# EAGLE design akabeacon_square_type2 (EAGLE 7.2.0)
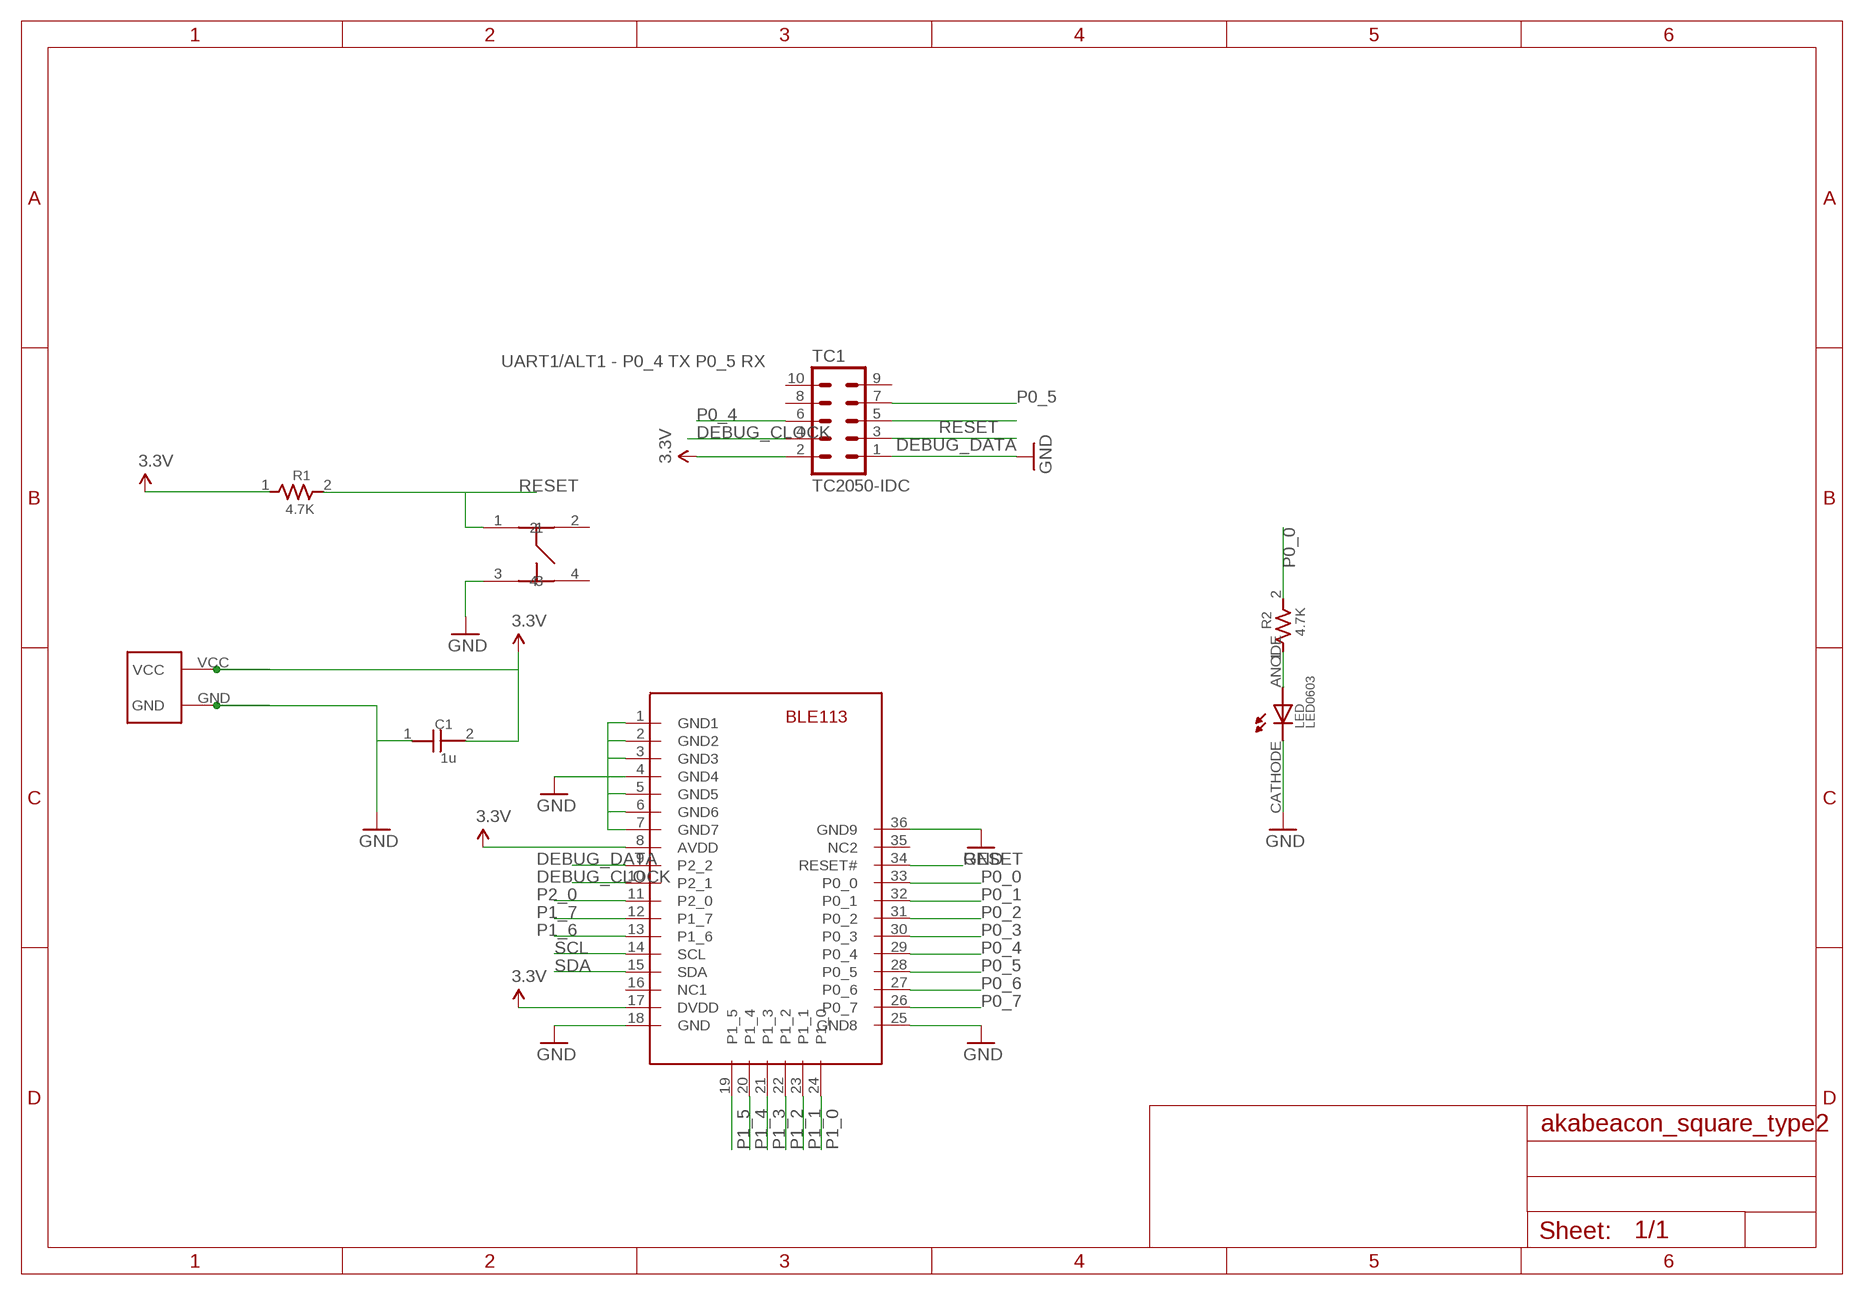
[diagram p0: schematic, sheet 1]

## Parts
C1  1u  CAPACITOR0603  [0603]
LED  LED0603  [0603]
R1  4.7K  RESISTOR0603  [0603]
R2  4.7K  RESISTOR0603  [0603]
TC1  TC2050-IDC  [TC2050-IDC-NL]
U$3  SQUARE-TYPE2-TC2050  [SQUARE-TYPE2-TC2050]
U$5  BLE113  [BLE113]
U$6  SWICTH-4P(KMR2)  [SWITCH-4P(KMR2)]

## Nets
3.3V: C1.2 R1.1 TC1.2 U$3.VCC U$5.8(AVDD) U$5.17(DVDD)
DEBUG_CLOCK: TC1.4 U$5.10(P2_1)
DEBUG_DATA: TC1.3 U$5.9(P2_2)
GND: C1.1 LED.CATHODE TC1.1 U$3.GND U$5.1(GND1) U$5.2(GND2) U$5.3(GND3) U$5.4(GND4) U$5.5(GND5) U$5.6(GND6) U$5.7(GND7) U$5.18(GND) U$5.25(GND8) U$5.36(GND9) U$6.3
N$2: LED.ANODE R2.1
P0_0: R2.2 U$5.33(P0_0)
P0_1: U$5.32(P0_1)
P0_2: U$5.31(P0_2)
P0_3: U$5.30(P0_3)
P0_4: TC1.6 U$5.29(P0_4)
P0_5: TC1.7 U$5.28(P0_5)
P0_6: U$5.27(P0_6)
P0_7: U$5.26(P0_7)
P1_0: U$5.24(P1_0)
P1_1: U$5.23(P1_1)
P1_2: U$5.22(P1_2)
P1_3: U$5.21(P1_3)
P1_4: U$5.20(P1_4)
P1_5: U$5.19(P1_5)
P1_6: U$5.13(P1_6)
P1_7: U$5.12(P1_7)
P2_0: U$5.11(P2_0)
RESET: R1.2 TC1.5 U$5.34(RESET#) U$6.1
SCL: U$5.14(SCL)
SDA: U$5.15(SDA)
Unconnected: TC1.8 TC1.9 TC1.10 U$5.16(NC1) U$5.35(NC2) U$6.2 U$6.4

## Notes on the sheet
- UART1/ALT1 - P0_4 TX P0_5 RX

## Library data of the parts
C1 = GClue-Capacitor:CAPACITOR
LED = GClue-LED:LED
R1 R2 = GClue-Resistors:RESISTOR
TC1 = TagConnect:TC2050-IDC: Tag-Connect In Circuit Programming & Debug Cable 10 Pin http://www.tag-connect.com
U$3 = GClue-Beacon:SQUARE-TYPE2-TC2050
U$5 = gclue:BLE113
U$6 = gclue:SWICTH-4P(KMR2)

## Board
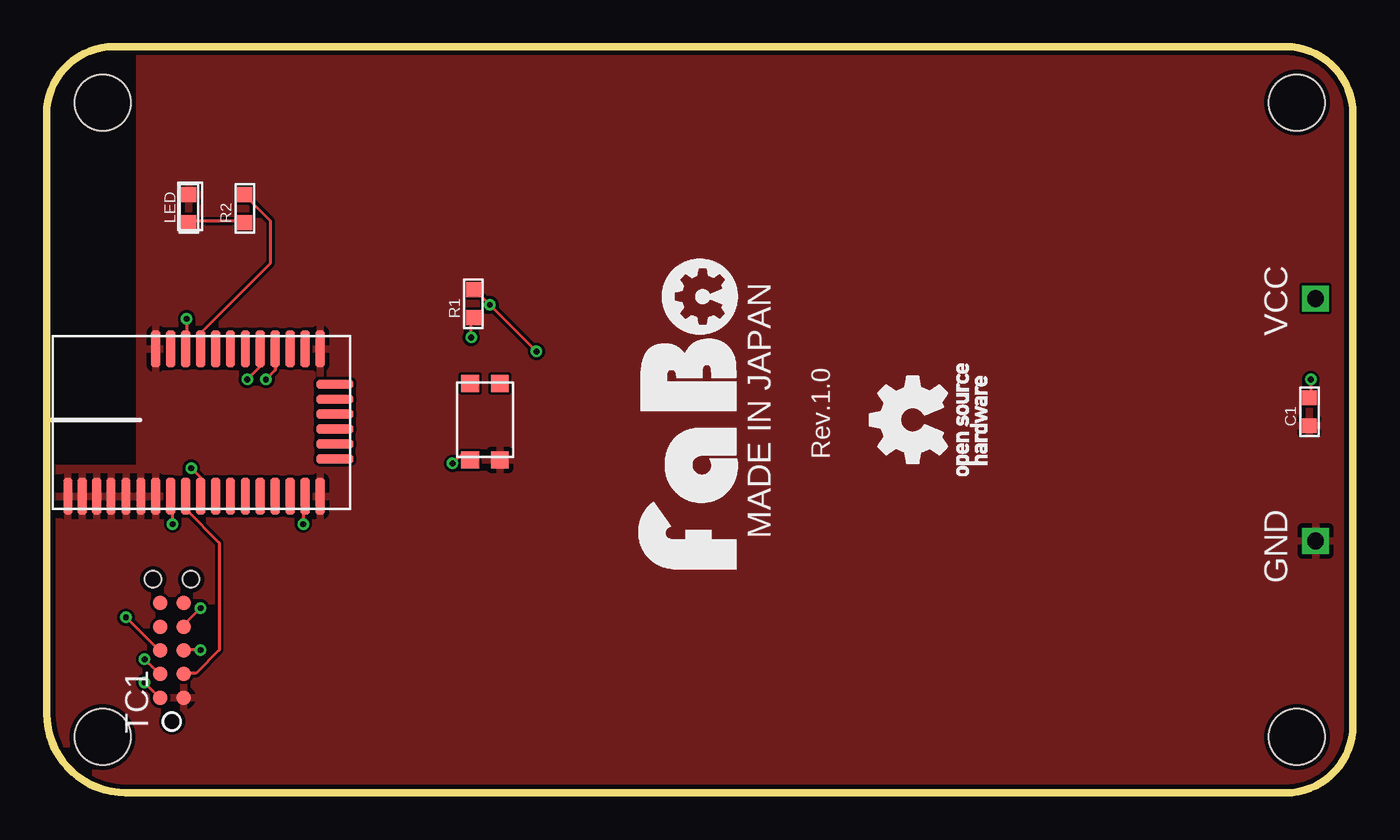
[diagram p1: board, top side]
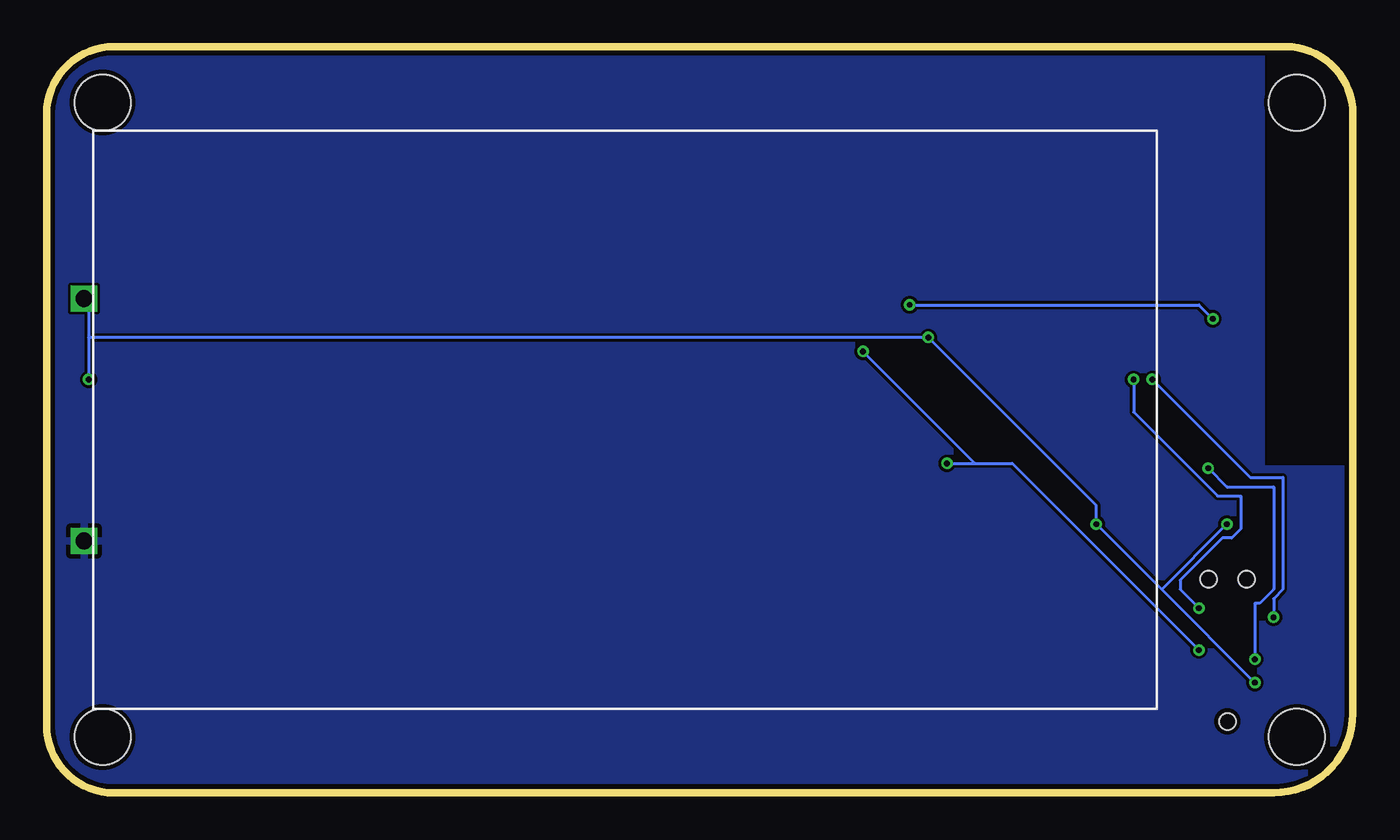
[diagram p2: board, bottom side, seen from below]

Size 70 x 40 mm. Coordinates in mm from the lower left corner, seen from the top.
Copper layers (1*16): Top 0.035mm / dielectric 1.5mm / Bottom 0.035mm
Design rules "SeeedStudio_2layer_DRU_no_angle_20140221": minimum track width 6mil, minimum drill 12mil, track to track 6mil, track to pad 6mil, pad to pad 6mil, via to via 6mil, smd to smd 0mil, copper to edge 10mil, drill to drill 10mil, minimum pad ring 10mil, minimum via ring 6mil, stop-mask expansion 2mil, vias tented up to drill 100mil, thermal gap 10mil
tRestrict: area -2.1,17.6 to 4.8,41
bRestrict: area -2.2,17.6 to 4.7,41

### Footprints (pad centres in the part's own frame; a part is rotated, then mirrored left to right if it is on the bottom)
0603 = smd 0.8 x 0.8: 1 -0.75,0; 2 0.75,0
0603' = smd 0.8 x 0.8: ANODE -0.75,0; CATHODE 0.75,0
TC2050-IDC-NL = smd 0.787 x 0.787: 1 -2.54,-0.635; 2 -2.54,0.635; 3 -1.27,-0.635; 4 -1.27,0.635; 5 0,-0.635; 6 0,0.635; 7 1.27,-0.635; 8 1.27,0.635; 9 2.54,-0.635; 10 2.54,0.635 | hole 0.889: -3.81,0; 3.81,-1.016; 3.81,1.016
SQUARE-TYPE2-TC2050 = drill 0.9 square: GND 33,-6.5; VCC 33,6.5 | hole 3: -32,17; -32,-17; 32,-17; 32,17
BLE113 = smd 2 x 0.5: 1 -5.08,5.08; 2 -5.08,4.31; 3 -5.08,3.54; 4 -5.08,2.77; 5 -5.08,1.97; 6 -5.08,1.17; 7 -5.08,0.37; 8 -5.08,-0.43; 9 -5.08,-1.23; 10 -5.08,-2.03; 11 -5.08,-2.83; 12 -5.08,-3.63; 13 -5.08,-4.43; 14 -5.08,-5.23; 15 -5.08,-6.03; 16 -5.08,-6.83; 17 -5.08,-7.63; 18 -5.08,-8.43; 25 2.82,-8.43; 26 2.82,-7.63; 27 2.82,-6.83; 28 2.82,-6.03; 29 2.82,-5.23; 30 2.82,-4.43; 31 2.82,-3.63; 32 2.82,-2.83; 33 2.82,-2.03; 34 2.82,-1.23; 35 2.82,-0.43; 36 2.82,0.37 | smd 0.5 x 2: 19 -3.08,-9.23; 20 -2.28,-9.23; 21 -1.48,-9.23; 22 -0.68,-9.23; 23 0.12,-9.23; 24 0.92,-9.23
SWITCH-4P(KMR2) = smd 0.9 x 0.95: 1 -1,0; 2 3.1,0; 3 -1,-1.6; 4 3.1,-1.6

### Placement (x,y rotation side)
C1  67.67,20.43 90 top
LED  LED0603  [0603']  7.62,31.32 90 top
R1  22.87,26.22 90 top
R2  10.62,31.32 90 top
TC1  6.72,7.64 90 top
U$3  35,20 0 top
U$5  6.22,20.98 90 top
U$6  22.69,18.84 90 top

### Tracks (layer width: path | path; a pad name or v marks a point on that pad's centre or on a via)
3.3V  (via drill 0.3)
  Top 0.152: v67.75,22.16 67.75,21.41 C1.2 | v5.25,5.91 6,5.16 TC1.2 | v13.75,14.41 13.75,15.66 U$5.17 | v22.75,24.41 22.75,25.41 R1.1 | v6.75,14.41 6.75,15.66 U$5.8
  Bottom 0.152: 67.75,24.41 67.75,26.41 68,26.41 U$3.VCC | 67.75,24.41 v67.75,22.16 | 10.25,10.91 v13.75,14.41 13.75,15.41 v22.75,24.41 67.75,24.41 | 10.25,10.91 v5.25,5.91 | 10.25,10.91 v6.75,14.41
DEBUG_CLOCK  (via drill 0.3)
  Top 0.152: v5.25,7.16 6,6.41 TC1.4 | v7.75,17.41 8.25,16.91 U$5.10
  Bottom 0.152: v5.25,7.16 5.25,10.16 5,10.16 4.25,10.91 4.25,16.41 6.75,16.41 v7.75,17.41
DEBUG_DATA
  Top 0.152: TC1.3 7.5,6.41 8,6.41 9.25,7.66 9.25,13.41 7.5,15.16 7.5,15.66 U$5.9
GND
  pour Top: 0,-0.09 71,-0.09 71,40.91 0,40.91
  pour Bottom: 0,-0.09 71,-0.09 71,40.91 0,40.91
N$2
  Top 0.152: LED.ANODE 7.75,30.66 10.5,30.66 R2.1
P0_0
  Top 0.152: U$5.33 8.25,24.66 12,28.41 12,30.66 10.75,31.91 R2.2
P0_4  (via drill 0.3)
  Top 0.152: v4.25,9.41 6,7.66 TC1.6 | v10.75,22.16 11.5,22.91 11.5,23.66 U$5.29
  Bottom 0.152: v4.25,9.41 4.25,10.41 3.75,10.91 3.75,16.91 5.5,16.91 v10.75,22.16
P0_5  (via drill 0.3)
  Top 0.152: v8.25,9.91 7.5,9.16 7.5,8.91 TC1.7 | v11.75,22.16 12.25,22.66 U$5.28
  Bottom 0.152: v8.25,9.91 9.25,10.91 9.25,11.41 7,13.66 6.5,13.66 6,14.16 6,15.91 7.25,15.91 11.75,20.41 v11.75,22.16
RESET  (via drill 0.3)
  Top 0.152: v8.25,7.66 7.5,7.66 TC1.5 | v21.75,17.66 22.25,18.16 22.5,18.16 22.75,17.91 U$6.1 | v26.25,23.66 v23.75,26.16 23,26.91 R1.2 | v7.5,25.41 7.5,23.91 U$5.34
  Bottom 0.152: v8.25,7.66 18.25,17.66 20.25,17.66 | v21.75,17.66 20.25,17.66 | 20.25,17.66 v26.25,23.66 | v7.5,25.41 8.25,26.16 v23.75,26.16

### Text on the board
tPlace: Rev.1.0